# EAGLE design MadHatterSchematic (EAGLE 9.6.2)
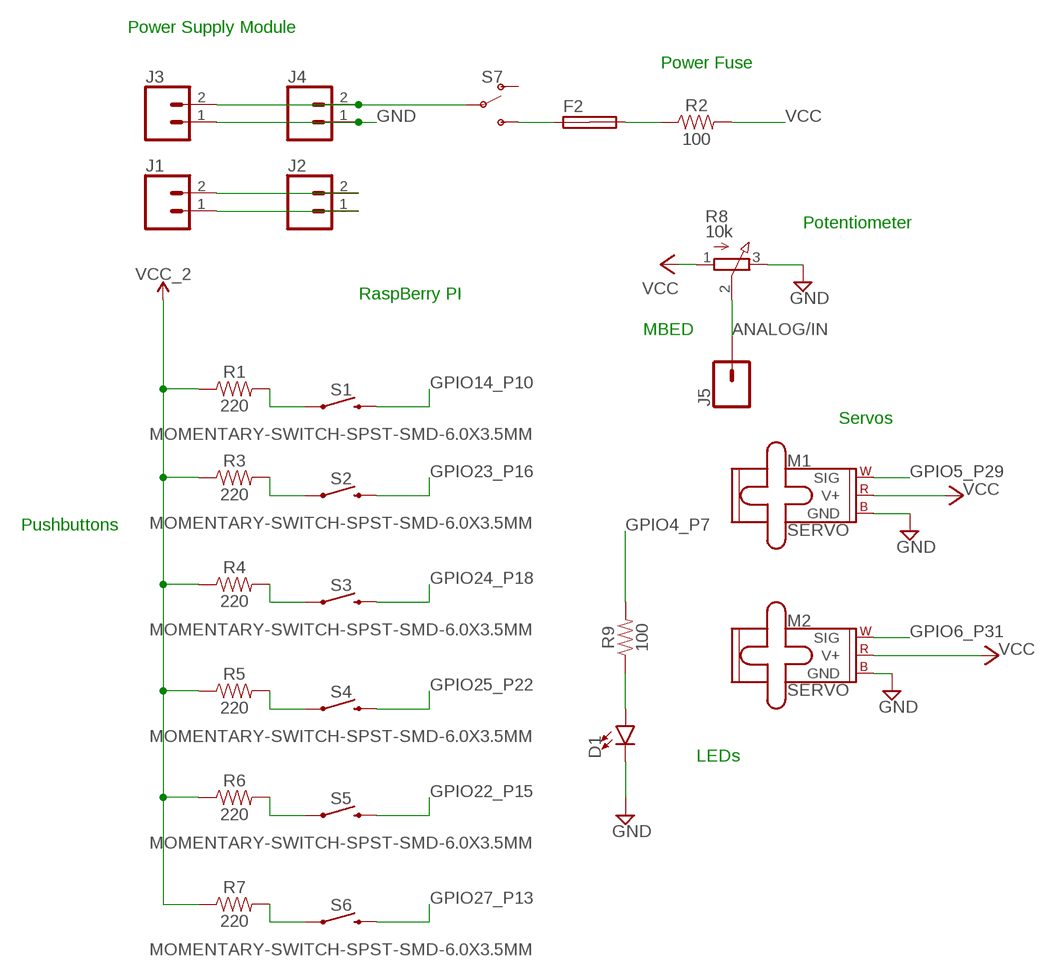
[diagram p0: schematic, sheet 1]

## Parts
D1  LED0603  [LED-0603]
F2  SHKOG  [SHKOG]
J1  CONN_02PTH_RA_FEMALE  [1X02_RA_PTH_FEMALE]
J2  CONN_02PTH_RA_FEMALE  [1X02_RA_PTH_FEMALE]
J3  CONN_02PTH_RA_FEMALE  [1X02_RA_PTH_FEMALE]
J4  CONN_02PTH_RA_FEMALE  [1X02_RA_PTH_FEMALE]
J5  CONN_01SNAP-FEMALE  [SNAP-FEMALE]
M1  SERVO  [1X03]
M2  SERVO  [1X03]
R1  220  220OHM-0402-TIGHT-1/16W-1%  [0402-TIGHT]
R2  100  100OHM-0402-TIGHT-1/16W-1%  [0402-TIGHT]
R3  220  220OHM-0402-TIGHT-1/16W-1%  [0402-TIGHT]
R4  220  220OHM-0402-TIGHT-1/16W-1%  [0402-TIGHT]
R5  220  220OHM-0402-TIGHT-1/16W-1%  [0402-TIGHT]
R6  220  220OHM-0402-TIGHT-1/16W-1%  [0402-TIGHT]
R7  220  220OHM-0402-TIGHT-1/16W-1%  [0402-TIGHT]
R8  10k  3RP/1610N  [3RP/1610N]
R9  100  100OHM-0402-TIGHT-1/16W-1%  [0402-TIGHT]
S1  MOMENTARY-SWITCH-SPST-SMD-6.0X3.5MM  [TACTILE_SWITCH_SMD_6.0X3.5MM]
S2  MOMENTARY-SWITCH-SPST-SMD-6.0X3.5MM  [TACTILE_SWITCH_SMD_6.0X3.5MM]
S3  MOMENTARY-SWITCH-SPST-SMD-6.0X3.5MM  [TACTILE_SWITCH_SMD_6.0X3.5MM]
S4  MOMENTARY-SWITCH-SPST-SMD-6.0X3.5MM  [TACTILE_SWITCH_SMD_6.0X3.5MM]
S5  MOMENTARY-SWITCH-SPST-SMD-6.0X3.5MM  [TACTILE_SWITCH_SMD_6.0X3.5MM]
S6  MOMENTARY-SWITCH-SPST-SMD-6.0X3.5MM  [TACTILE_SWITCH_SMD_6.0X3.5MM]
S7  SWITCH-SPDT-PTH-11.6X4.0MM  [SWITCH_SPDT_PTH_11.6X4.0MM]

## Nets
ANALOG/IN: J5.1 R8.2(S)
GND: D1.C J1.1 J2.1 J3.1 J4.1 M1.3(GND) M2.3(GND) R8.3(E)
GPIO4_P7: R9.2
GPIO5_P29: M1.1(SIG)
GPIO6_P31: M2.1(SIG)
GPIO14_P10: S1.2
GPIO22_P15: S5.2
GPIO23_P16: S2.2
GPIO24_P18: S3.2
GPIO25_P22: S4.2
GPIO27_P13: S6.2
N$1: F2.1A S7.3(S)
N$2: R3.2 S2.1
N$3: F2.2A R2.1
N$4: D1.A R9.1
N$5: R1.2 S1.1
N$6: R4.2 S3.1
N$7: R5.2 S4.1
N$8: R6.2 S5.1
N$9: R7.2 S6.1
VCC: J1.2 J2.2 J3.2 J4.2 M1.2(V+) M2.2(V+) R2.2 R8.1(A) S7.2(P)
VCC_2: R1.1 R3.1 R4.1 R5.1 R6.1 R7.1
Unconnected: F2.1B F2.2B S7.1(O)

## Notes on the sheet
- Power Supply Module
- Power Fuse
- Potentiometer
- RaspBerry PI
- MBED
- Servos
- Pushbuttons
- LEDs

## Library data of the parts
D1 = SparkFun-LED:LED: LED (Generic) Standard schematic elements and footprints for 5mm, 3mm, 1206, and 0603 sized LEDs. Generic LEDs with no color specified.
F2 = fuse:SHKOG: FUSE HOLDER 5 x 20/6 x 32 mm, SH contact, OG 46G6083 Buerklin; OC_FARNELL: unknown; OC_NEWARK: unknown
J1-J4 = SparkFun-Connectors:CONN_02: Multi connection point. Often used as Generic Header-pin footprint for 0.1 inch spaced/style header connections On any of the 0.1 inch spaced packages, you can populate with these: Break Away Headers - Straight <https://www.sparkfun.com/products/116> (PRT-00116) Break Away Male Headers - Right Angle <https://www.sparkfun.com/products/553> (PRT-00553) Female Headers <https://www.sparkfun.com/products/115> (PRT-00115) Break Away Headers - Machine Pin <https://www.sparkfun.com/products/117> (PRT-00117) Break Away Female Headers - Swiss Machine Pin <https://www.sparkfun.com/products/743> (PRT-00743) For SCREWTERMINALS and SPRING TERMINALS visit here: Screw Terimnals on SparkFun.com <https://www.sparkfun.com/search/results?term=Screw+Terminals> (5mm/3.5mm/2.54mm spacing) This device is also useful as a general connection point to wire up your design to another part of your project. Our various solder wires solder well into these plated through hole pads. Hook-Up Wire - Assortment (Stranded, 22 AWG) <https://www.sparkfun.com/products/11375> (PRT-11375) Hook-Up Wire - Assortment (Solid Core, 22 AWG) <https://www.sparkfun.com/products/11367> (PRT-11367) View the entire wire category on our website here <https://www.sparkfun.com/categories/141> Special notes: Molex polarized connector foot print use with: PRT-08233 with associated crimp pins and housings. 2.54_SCREWTERM for use with PRT-10571. 3.5mm Screw Terminal footprints for PRT-08084 5mm Screw Terminal footprints for use with PRT-08432; PROD_ID: CONN-13700
J5 = SparkFun-Connectors:CONN_01: Single connection point. Often used as Generic Header-pin footprint for 0.1 inch spaced/style header connections On any of the 0.1 inch spaced packages, you can populate with these: Break Away Headers - Straight <https://www.sparkfun.com/products/116> (PRT-00116) Break Away Male Headers - Right Angle <https://www.sparkfun.com/products/553> (PRT-00553) Female Headers <https://www.sparkfun.com/products/115> (PRT-00115) Break Away Headers - Machine Pin <https://www.sparkfun.com/products/117> (PRT-00117) Break Away Female Headers - Swiss Machine Pin <https://www.sparkfun.com/products/743> (PRT-00743) This device is also useful as a general connection point to wire up your design to another part of your project. Our various solder wires solder well into these plated through hole pads. Hook-Up Wire - Assortment (Stranded, 22 AWG) <https://www.sparkfun.com/products/11375> (PRT-11375) Hook-Up Wire - Assortment (Solid Core, 22 AWG) <https://www.sparkfun.com/products/11367> (PRT-11367) View the entire wire category on our website here <https://www.sparkfun.com/categories/141> Special notes: SMTSO-256-ET is a "flush mount" nut for a 4-40 screw. We mostly use this on specialty testbeds; it is a nice way to connect hardware to your PCB at an adjustable hieght. Also note, the SNAP packages are for using a snappable style connector. We sell a baggie of snaps and they are also used on two LilyPad designs: Snap Assortment - 30 pack (male and female) <https://www.sparkfun.com/products/11347> (DEV-11347) LilyPad Arduino SimpleSnap <https://www.sparkfun.com/products/10941> (DEV-10941) LilyPad SimpleSnap Protoboard <https://www.sparkfun.com/products/10940> (DEV-10940)
M1 M2 = SparkFun-Electromechanical:SERVO: Servo Motor 3-pin connector for a standard servo motor (voltage supply, ground, and control signal.) SparkFun Products Servo - Generic (Sub-Micro Size) <https://www.sparkfun.com/products/9065> (ROB-09065) Servo - Generic High Torque Continuous Rotation (Standard Size) <https://www.sparkfun.com/products/9347> (ROB-09347) Servo - Generic High Torque (Standard Size) <https://www.sparkfun.com/products/11965> (ROB-11965)
R1 R3-R7 = SparkFun-Resistors:220OHM: 220Ω resistor A resistor is a passive two-terminal electrical component that implements electrical resistance as a circuit element. Resistors act to reduce current flow, and, at the same time, act to lower voltage levels within circuits. - Wikipedia; PROD_ID: RES-15269
R2 R9 = SparkFun-Resistors:100OHM: 100Ω resistor A resistor is a passive two-terminal electrical component that implements electrical resistance as a circuit element. Resistors act to reduce current flow, and, at the same time, act to lower voltage levels within circuits. - Wikipedia; PROD_ID: RES-14962
R8 = pot:3RP/1610N: 16mm Potentiometer one level Source: http://www.alphapotentiometers.net/html/16mm_pot_2.html
S1-S6 = SparkFun-Switches:MOMENTARY-SWITCH-SPST: Momentary Switch (Pushbutton) - SPST Normally-open (NO) SPST momentary switches (buttons, pushbuttons). Variants PTH-12MM - 12mm square, through-hole Momentary Pushbutton Switch - 12mm Square <https://www.sparkfun.com/products/9190> (COM-09190) PTH-6.0MM, PTH-6.0MM-KIT - 6.0mm square, through-hole Mini Pushbutton Switch <https://www.sparkfun.com/products/97> (COM-00097) KIT package intended for soldering kit's - only one side of pads' copper is exposed. PTH-RIGHT-ANGLE-KIT - Right-angle, through-hole Right Angle Tactile Button <https://www.sparkfun.com/products/10791> - Used on SparkFun BigTime Watch Kit <https://www.sparkfun.com/products/11734> SMD-12MM - 12mm square, surface-mount Tactile Button - SMD (12mm) <https://www.sparkfun.com/products/12993> (COM-12993) Used on SparkFun PicoBoard <https://www.sparkfun.com/products/11888> SMD-4.5MM - 4.5mm Square Trackball Switch Used on SparkFun Blackberry Trackballer Breakout <https://www.sparkfun.com/products/13169> SMD-4.6MMX2.8MM - 4.60mm x 2.80mm, surface mount Used on SparkFun Pro Micro - RP2040 <https://www.sparkfun.com/products/17717> SMD-5.2MM, SMD-5.2-REDUNDANT - 5.2mm square, surface-mount Mini Pushbutton Switch - SMD <https://www.sparkfun.com/products/8720> (COM-08720) Used on Arduino Pro Mini <https://www.sparkfun.com/products/11114> REDUNDANT package connects both switch circuits together SMD-6.0X3.5MM - 6.0 x 3.5mm, surface mount Momentary Reset Switch SMD <https://www.sparkfun.com/products/8229> (COM-08229) SMD-6.2MM-TALL - 6.2mm square, surface mount Tactile Button - SMD (6mm) <https://www.sparkfun.com/products/12992> Used on SparkFun Digital Sandbox <https://www.sparkfun.com/products/12651> SMD-RIGHT-ANGLE - Right-angle, surface mount Used on SparkFun Block for Intel® Edison - Arduino <https://www.sparkfun.com/products/13036>; PROD_ID: SWCH-14278; SF_SKU: COM-08229
S7 = SparkFun-Switches:SWITCH-SPDT: Single Pole, Double Throw (SPDT) Switch Single-pole, double-throw (SPDT) switch. Variant Overview SMD-AYZ0202 Surface Mount DPDT Switch <https://www.sparkfun.com/products/597> (COM-00597) Used on e.g. LilyPad Arduino USB - ATmega32U4 Board <https://www.sparkfun.com/products/12049> PTH-11.6X4.0MM SPDT Mini Power Switch <https://www.sparkfun.com/products/102> (COM-00102) Used on e.g. SparkFun Simon Says - Through-Hole Soldering Kit <https://www.sparkfun.com/products/10547> (KIT-10547) PTH-11.6X4.0MM-KIT KIT version of SPDT Mini Power Switch - Simplifies soldering by removing tStop of switch pins - only one side can be soldered. PTH-11.6X4.0MM-LOCK LOCK version of SPDT Mini Power Switch - Offset pins hold switch in place for easier soldering. SMD-RIGHT-ANGLE Surface Mount Right Angle Switch <https://www.sparkfun.com/products/10860> (COM-10860) Used on e.g. SparkFun ESP8266 Thing <https://www.sparkfun.com/products/13231>; PROD_ID: SWCH-08261; SF_SKU: COM-00102

## Board
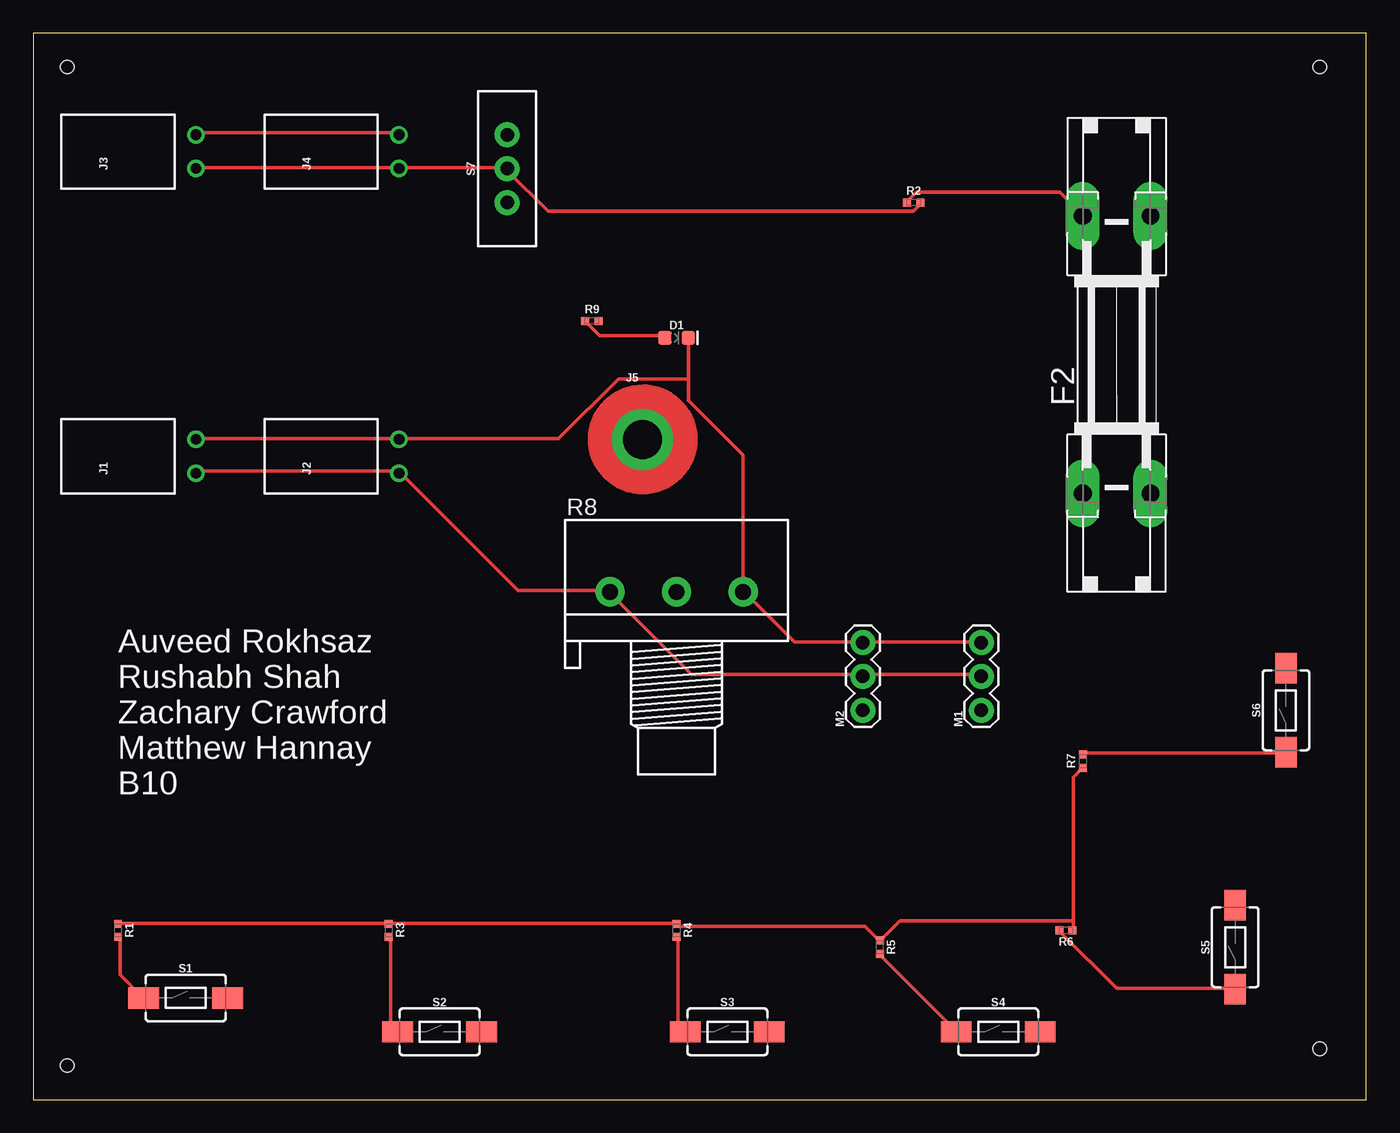
[diagram p1: board, top side]
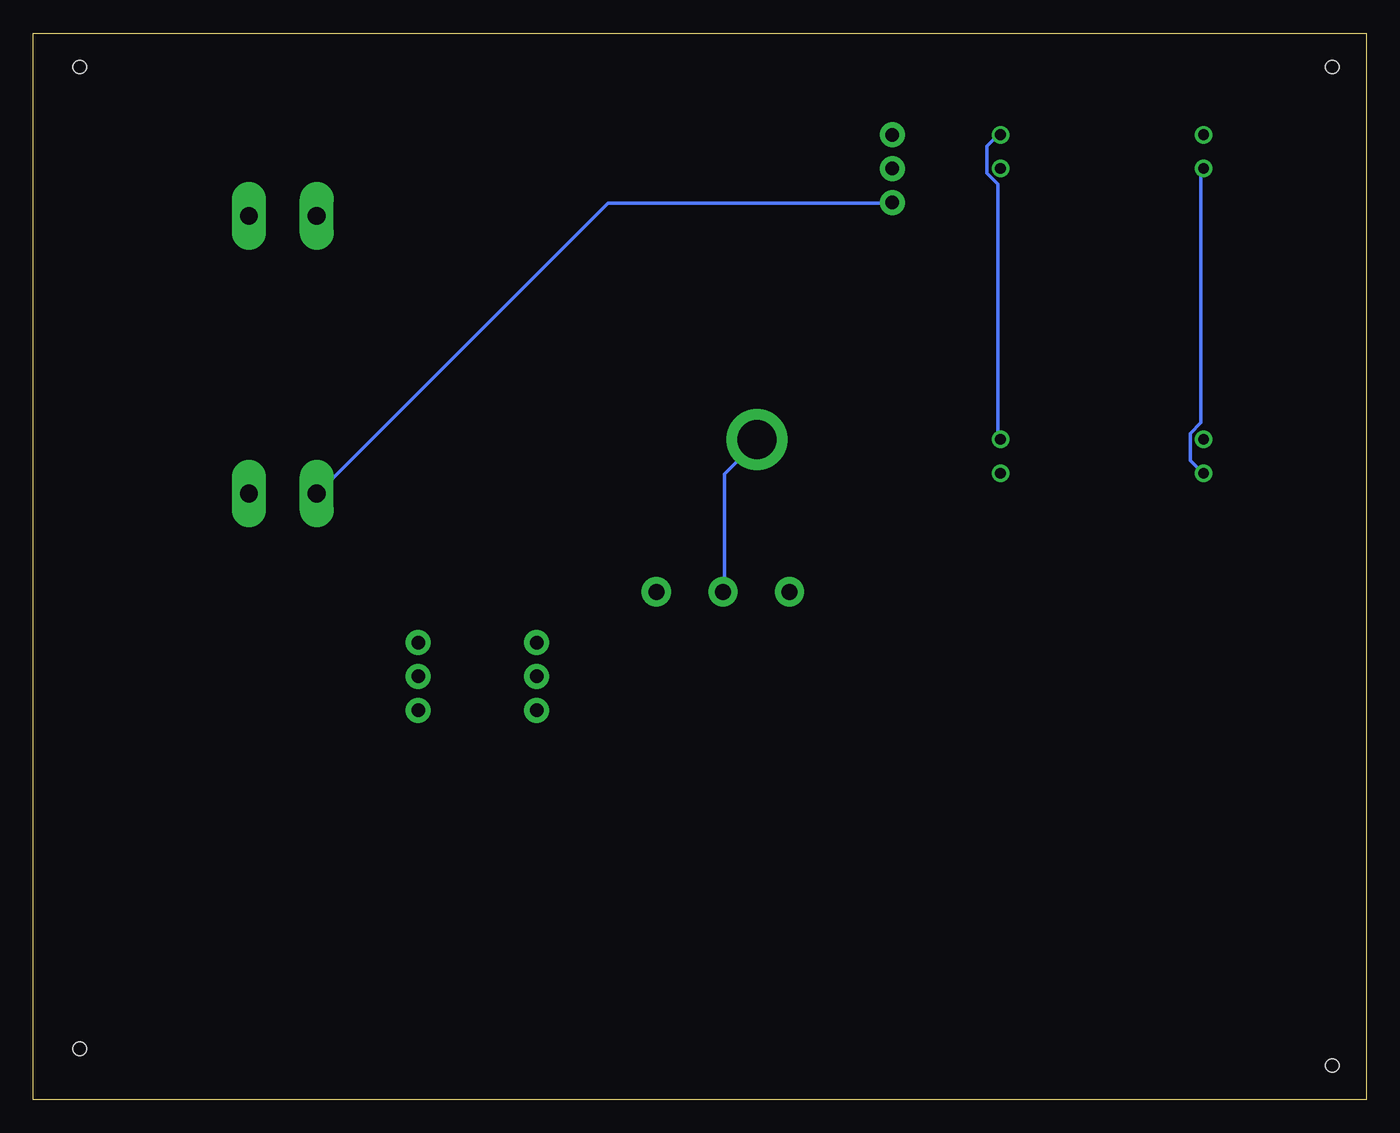
[diagram p2: board, bottom side, seen from below]

Size 100 x 80 mm. Coordinates in mm from the lower left corner, seen from the top.
Outline: 0,0 100,0 100,80 0,80 0,0
Copper layers (1*16): Top 0.035mm / dielectric 1.5mm / Bottom 0.035mm
Design rules "default *": minimum track width 10mil, minimum drill 0.35mm, track to track 6mil, track to pad 6mil, pad to pad 6mil, via to via 6mil, smd to smd 6mil, copper to edge 40mil, drill to drill 6mil, minimum pad ring 10mil, minimum via ring 8mil, stop-mask expansion 4mil, vias tented up to drill 0mil, thermal gap 10mil
Holes 1 mm at 2.54,77.47 96.52,77.47 96.52,3.81 2.54,2.54

### Footprints (pad centres in the part's own frame; a part is rotated, then mirrored left to right if it is on the bottom)
LED-0603 = smd 1 x 1: A -0.877,0; C 0.877,0
SHKOG = drill 1.321 pad 2.54 long: 1A -10.414,2.54; 1B -10.414,-2.54; 2A 10.414,2.54; 2B 10.414,-2.54
1X02_RA_PTH_FEMALE = drill 0.8: 1 1.27,-5.85; 2 -1.27,-5.85
SNAP-FEMALE = drill 2.921 pad 4.572: 1 0,0
1X03 = drill 1.016 pad 1.88: 1 0,0; 2 2.54,0; 3 5.08,0
0402-TIGHT = smd 0.6 x 0.6: 1 -0.5,0; 2 0.5,0
3RP/1610N = drill 1.2 pad 2.184: 1 -5,0; 2 0,0; 3 5,0
TACTILE_SWITCH_SMD_6.0X3.5MM = smd 2.3 x 1.6: 1 -3.15,0; 2 3.15,0
SWITCH_SPDT_PTH_11.6X4.0MM = drill 1.016 pad 1.88: 1 0,2.54; 2 0,0; 3 0,-2.54

### Placement (x,y rotation side)
D1  48.26,57.15 0 top
F2  81.28,55.88 90 top
J1  6.35,48.26 90 top
J2  21.59,48.26 90 top
J3  6.35,71.12 90 top
J4  21.59,71.12 90 top
J5  45.72,49.53 0 top
M1  71.12,29.21 90 top
M2  62.23,29.21 90 top
R1  6.35,12.7 270 top
R2  66.04,67.31 0 top
R3  26.67,12.7 270 top
R4  48.26,12.7 270 top
R5  63.5,11.43 270 top
R6  77.47,12.7 180 top
R7  78.74,25.4 90 top
R8  48.26,38.1 0 top
R9  41.91,58.42 0 top
S1  11.43,7.62 0 top
S2  30.48,5.08 0 top
S3  52.07,5.08 0 top
S4  72.39,5.08 0 top
S5  90.17,11.43 90 top
S6  93.98,29.21 90 top
S7  35.56,69.85 0 top

### Tracks (layer width: path | path; a pad name or v marks a point on that pad's centre or on a via)
ANALOG/IN
  Bottom 0.254: R8.2 48.16,38.2 48.16,46.94 45.72,49.38 J5.1
GND
  Top 0.254: J1.1 12.39,49.58 27.43,49.58 J2.1 27.64,49.58 39.42,49.58 43.89,54.05 49.17,54.05 | J3.1 12.39,72.54 27.43,72.54 J4.1 | M1.3 71.12,34.34 62.38,34.34 M2.3 62.18,34.34 57.1,34.34 53.44,38 R8.3 53.24,38.2 53.24,48.36 49.17,52.43 49.17,54.05 | 49.17,54.05 49.17,57.1 D1.C
  Bottom 0.254: J2.1 27.64,49.58 27.64,68.68 28.45,69.49 28.45,71.53 27.64,72.34 J4.1
N$1
  Bottom 0.254: S7.3 35.56,67.26 56.9,67.26 78.64,45.52 F2.1A
N$2
  Top 0.254: R3.2 26.82,12.19 26.82,5.49 27.23,5.08 S2.1
N$3
  Top 0.254: R2.1 65.63,67.46 66.24,68.07 77.01,68.07 78.64,66.45 F2.2A
N$4
  Top 0.254: R9.1 41.45,58.32 42.47,57.3 47.35,57.3 D1.A
N$5
  Top 0.254: R1.2 6.5,12.19 6.5,9.35 8.13,7.72 S1.1
N$6
  Top 0.254: R4.2 48.36,12.19 48.36,5.49 48.77,5.08 S3.1
N$7
  Top 0.254: R5.2 63.6,10.77 69.29,5.08 S4.1
N$8
  Top 0.254: R6.2 77.01,12.6 81.28,8.33 90.02,8.33 S5.1
N$9
  Top 0.254: R7.2 78.84,26.01 93.88,26.01 S6.1
VCC
  Top 0.254: J3.2 12.39,69.9 27.43,69.9 J4.2 27.64,69.9 35.56,69.9 S7.2 35.56,69.7 38.61,66.65 66.04,66.65 66.45,67.06 66.45,67.26 R2.2 | M1.2 71.12,31.9 62.38,31.9 M2.2 62.18,31.9 49.38,31.9 43.28,38 R8.1 43.08,38.2 36.37,38.2 27.64,46.94 J2.2 27.43,47.14 12.39,47.14 J1.2
  Bottom 0.254: J3.2 12.39,69.7 12.39,50.8 13.21,49.99 13.21,47.95 12.39,47.14 J1.2
VCC_2
  Top 0.254: R1.1 6.5,13.21 26.62,13.21 R3.1 26.82,13.21 48.16,13.21 R4.1 48.36,13.01 62.38,13.01 63.4,11.99 R5.1 63.6,11.99 65.02,13.41 78.03,13.41 | 78.03,13.41 78.03,24.18 78.64,24.79 R7.1 | 78.03,13.41 78.03,12.8 R6.1

### Text on the board
tPlace: Auveed Rokhsaz / Rushabh Shah / Zachary Crawford / Matthew Hannay / B10